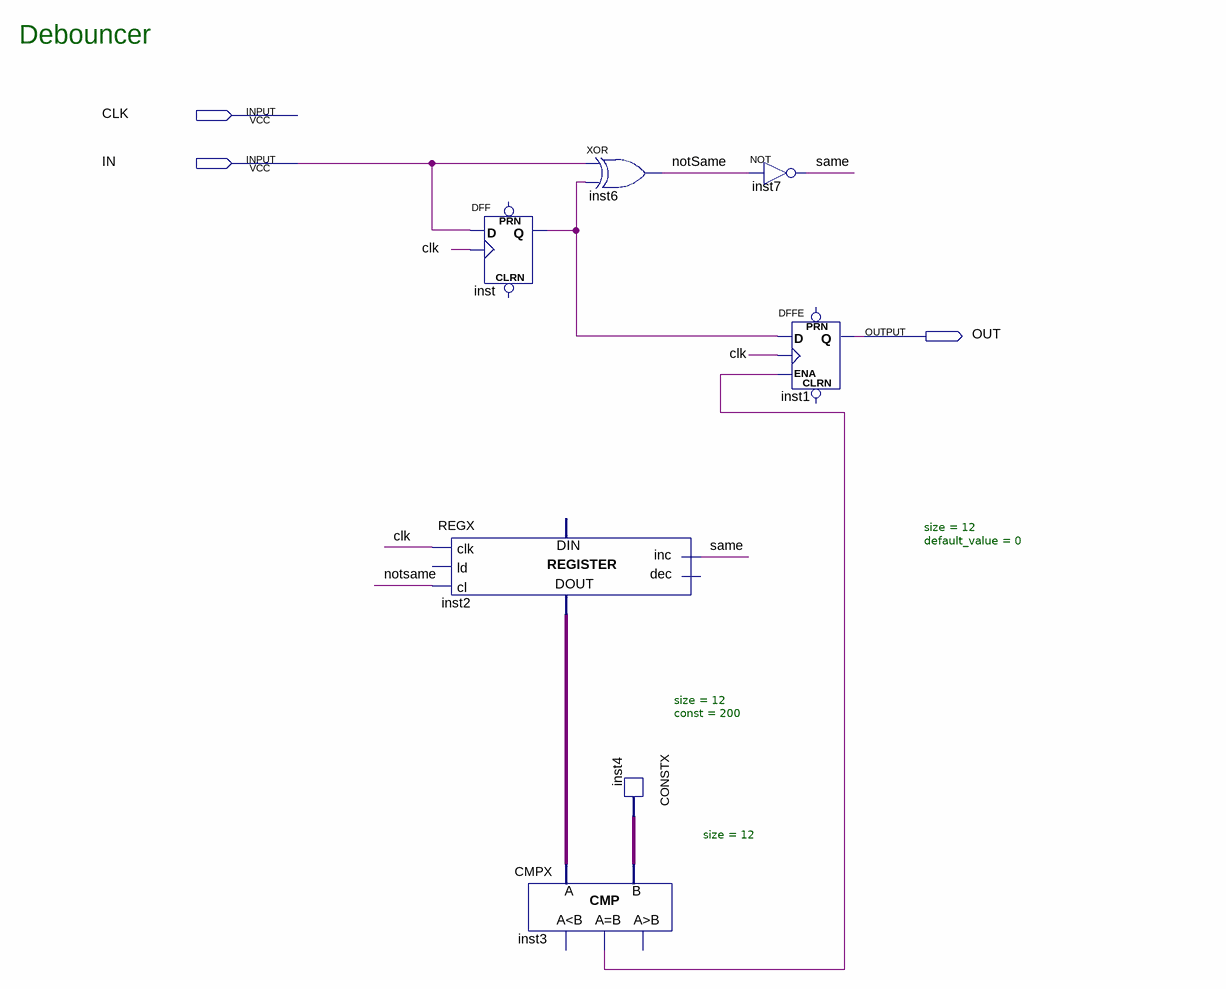
[diagram p0: schematic sheet]
// Quartus schematic Debouncer.bdf as structural Verilog: 7 symbols, 3 pins
module Debouncer (
  input  CLK,
  input  IN,
  output OUT
);

  wire inst3_eq, inst_q, notSame, same;
  wire [11:0] inst2_data_out, inst4_data;

  REGX #(.size(12), .default_value(0)) inst2 (
    .clk(CLK), .cl(notSame), .inc(same), .data_out(inst2_data_out));  // open: ld, dec, data_in
  DFF inst (.CLK(CLK), .D(IN), .Q(inst_q));  // open: CLRN, PRN
  CMPX #(.size(12)) inst3 (.A(inst2_data_out), .B(inst4_data), .eq(inst3_eq));  // open: ls, gr
  xor inst6 (notSame, IN, inst_q);
  CONSTX #(.size(12), .\const (200)) inst4 (.data(inst4_data));
  not inst7 (same, notSame);
  DFFE inst1 (.D(inst_q), .CLK(CLK), .ENA(inst3_eq), .Q(OUT));  // open: PRN, CLRN

  // Notes on the sheet:
  //   Debouncer
endmodule
